# Altium project FROGSBORO.PrjPcb (part 2 of 2)

## Sheet SD.SchDoc
size A; DocumentNumber: 5; SheetNumber: 5; SheetTotal: 6
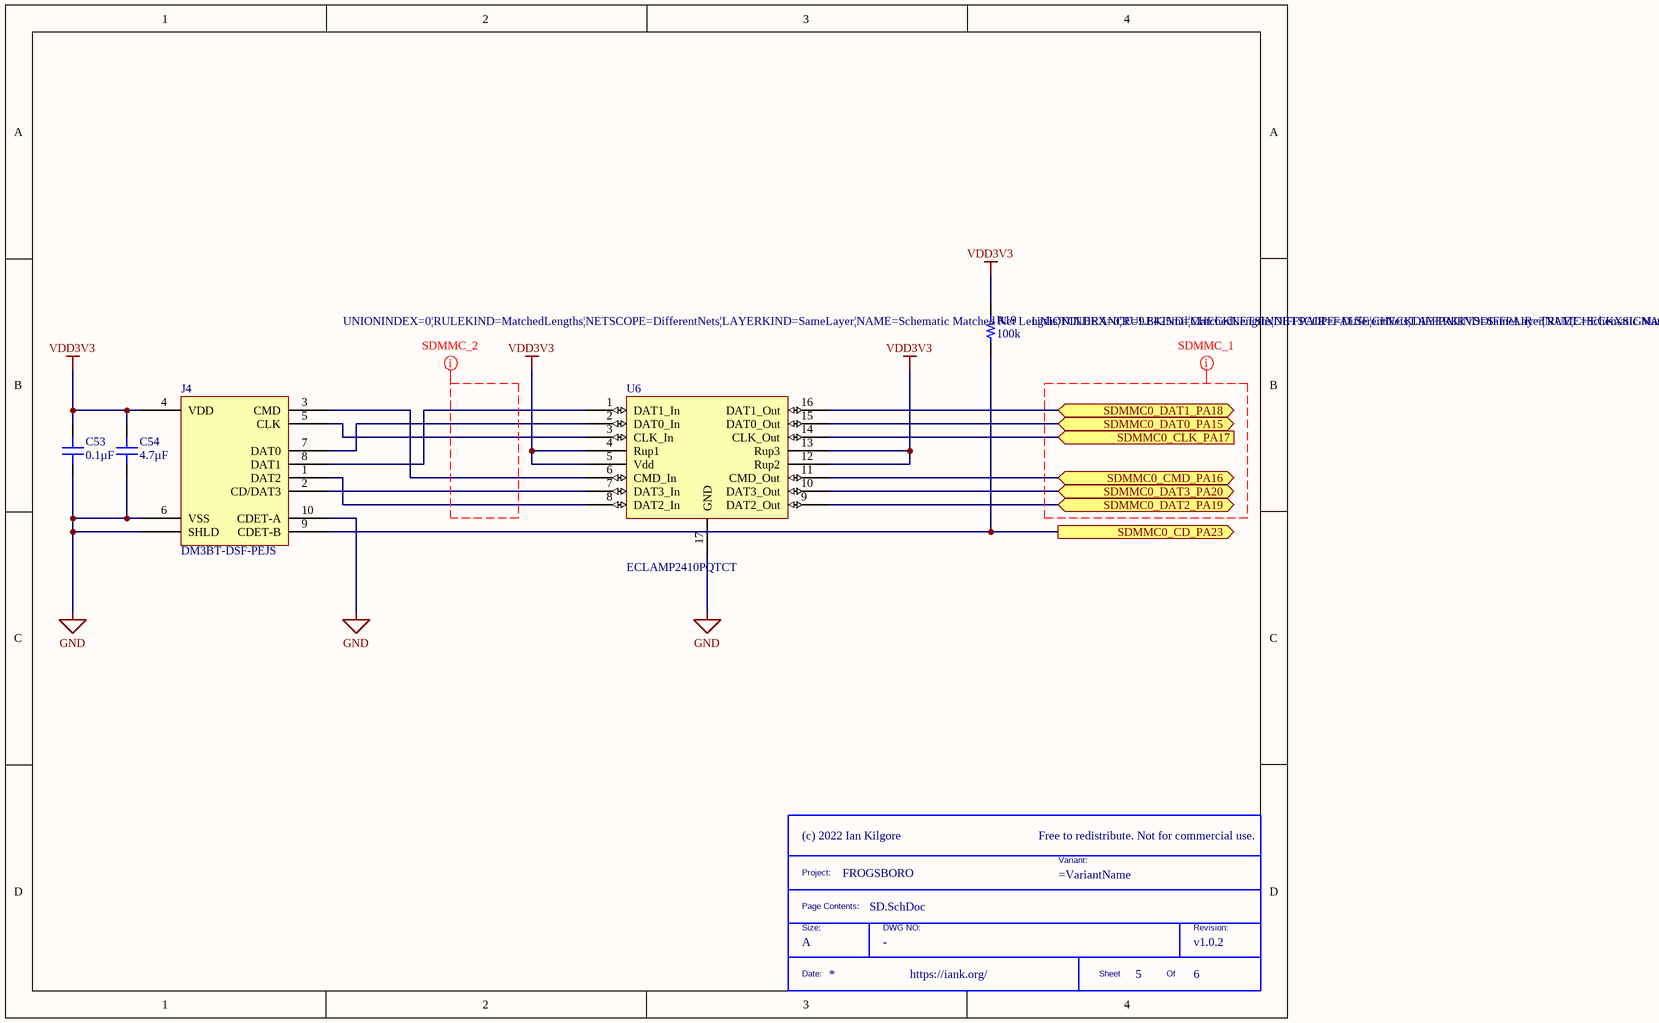
[diagram p4: SD.SchDoc]

### Parts
(Parts that share a designator on the sheet are numbered #1, #2 ... from top to bottom, then left to right.)
*#5  Size: A  (hidden comment: TitleBlock)  (graphical)
C53  0.1µF  [CAP 0402_1005]
C54  4.7µF  [CAP 0402_1005]
J4  DM3BT-DSF-PEJS  [HIROSE DM3BT-DSF-PEJS]
R19  100k  [RES 0402_1005]
U6  ECLAMP2410PQTCT  [SON50P160X65_HS-17N]

### Ports
SDMMC0_CD_PA23 (out), SDMMC0_CLK_PA17 (in), SDMMC0_CMD_PA16 (bidir), SDMMC0_DAT0_PA15 (bidir), SDMMC0_DAT1_PA18 (bidir), SDMMC0_DAT2_PA19 (bidir), SDMMC0_DAT3_PA20 (bidir)

### Nets
GND: C53.2 C54.1 J4.6(VSS) J4.10(CDET-A) J4.S(SHLD) U6.17(GND)
VDD3V3: C53.1 C54.2 J4.4(VDD) R19.2 U6.4(Rup1) U6.5(Vdd) U6.12(Rup2) U6.13(Rup3)
NetJ4_1: J4.1(DAT2) U6.8(DAT2_In)
NetJ4_2: J4.2(CD/DAT3) U6.7(DAT3_In)
NetJ4_3: J4.3(CMD) U6.6(CMD_In)
NetJ4_5: J4.5(CLK) U6.3(CLK_In)
NetJ4_7: J4.7(DAT0) U6.2(DAT0_In)
NetJ4_8: J4.8(DAT1) U6.1(DAT1_In)
NetJ4_9: J4.9(CDET-B) R19.1 ; port SDMMC0_CD_PA23
NetU1_H3: U6.16(DAT1_Out) ; port SDMMC0_DAT1_PA18
NetU1_H4: U6.14(CLK_Out) ; port SDMMC0_CLK_PA17
NetU1_J1: U6.9(DAT2_Out) ; port SDMMC0_DAT2_PA19
NetU1_J2: U6.11(CMD_Out) ; port SDMMC0_CMD_PA16
NetU1_J4: U6.10(DAT3_Out) ; port SDMMC0_DAT3_PA20
NetU1_K1: U6.15(DAT0_Out) ; port SDMMC0_DAT0_PA15

### Layout directives
rule Matched Net Lengths [Tolerance = 0.25mm]: (no net found under the mark)

### Notes on the sheet
- (in symbol TitleBlock) Free to redistribute. Not for commercial use.; Project:; Variant:; Page Contents:; Size:; DWG NO:; Revision:; Date:; Sheet; Of

### Library data of the parts
*#5 = TitleBlock: Custom Title Block; DWG: -
C53 = C0402C104K4PACTU: CAP CER 0.1UF 16V X5R 0402; Manufacturer: KEMET; Tolerance: ±10%; Part Number: C0402C104K4PACTU; Value: 0.1µF; Applications: General Purpose; Capacitance: 0.1µF; ComponentLink1Description: Datasheet; ComponentLink1URL: https://api.kemet.com/component-edge/download/datasheet/C0402C104K4PACTU.pdf; ComponentLink2Description: DigiKey Link; ComponentLink2URL: http://digikey.com/product-detail/en/kemet/C0402C104K4PACTU/399-7762-1-ND/3471485; Device Package: 0402 (1005 Metric); LastUpdated: 9/2/2020 1:02:03 AM; Lifecycle Status: Active; Minimum Order: 1; Mounting Type: Surface Mount, MLCC; Operating Temperature: -55°C ~ 85°C; Package / Case: 0402 (1005 Metric); Packaging: TapeAndReel; PartId: 11334; Part Status: Active; Price: 0.01; Series: SMD Comm X5R; Size / Dimension: 0.039" L x 0.020" W (1.00mm x 0.50mm); Supplier 1: DigiKey; Supplier Part Number 1: 399-7762-1-ND; Temperature Coefficient: X5R; Thickness (Max): 0.022" (0.55mm); Voltage - Rated: 16V
C54 = CL05A475KP5NRNC: CAP CER 4.7UF 10V X5R 0402; Manufacturer: Samsung Electro-Mechanics; Tolerance: ±10%; Part Number: CL05A475KP5NRNC; Value: 4.7µF; Applications: General Purpose; Capacitance: 4.7µF; ComponentLink1Description: Datasheet; ComponentLink1URL: http://www.samsungsem.com/kr/support/product-search/mlcc/CL05A475KP5NRNC.jsp; ComponentLink2Description: DigiKey Link; ComponentLink2URL: http://digikey.com/product-detail/en/samsung-electro-mechanics/CL05A475KP5NRNC/1276-1480-1-ND/3889566; Device Package: 0402 (1005 Metric); LastUpdated: 9/2/2020 1:02:23 AM; Lifecycle Status: Active; Minimum Order: 1; Mounting Type: Surface Mount, MLCC; Operating Temperature: -55°C ~ 85°C; Package / Case: 0402 (1005 Metric); Packaging: TapeAndReel; PartId: 2191; Part Status: Active; Price: 0.08; Series: CL; Size / Dimension: 0.039" L x 0.020" W (1.00mm x 0.50mm); Supplier 1: DigiKey; Supplier Part Number 1: 1276-1480-1-ND; Temperature Coefficient: X5R; Thickness (Max): 0.022" (0.55mm); Voltage - Rated: 10V
J4 = DM3BT-DSF-PEJS: CONN MICRO SD CARD PUSH-PUSH R/A; Manufacturer: Hirose Electric Co Ltd; Card Type: Secure Digital - microSD™; Connector Type: Connector and Ejector; Insertion, Removal Method: Push In, Push Out; Number of Positions: 10 (8 + 2); Part Number: DM3BT-DSF-PEJS; ComponentLink1Description: Datasheet; ComponentLink1URL: https://www.hirose.com/product/download/?distributor=digikey&type=specSheet&lang=en&num=DM3BT-DSF-PEJS; ComponentLink2Description: DigiKey Link; ComponentLink2URL: //digikey.com/product-detail/en/hirose-electric-co-ltd/DM3BT-DSF-PEJS/HR1942TR-ND/1982749; Contact Finish: Gold; Features: Switch; Height Above Board: 0.072" (1.83mm); LastUpdated: 12/16/2019 8:35:34 PM; Lifecycle Status: 0; Minimum Order: 1; Mounting Feature: Reverse - Bottom; Mounting Type: Surface Mount, Right Angle; Packaging: TapeAndReel; Part Status: Active; Price: 1.25; Series: DM3; Supplier 1: DigiKey; Supplier Part Number 1: HR1942TR-ND
R19 = CRCW0402100KFKEDC: RES SMD 100K OHM 1% 1/16W 0402; Manufacturer: Vishay Dale; Power (Watts): 0.063W, 1/16W; Resistance: 100 kOhms; Temperature Coefficient: ±100ppm/°C; Part Number: CRCW0402100KFKEDC; Value: 100k; ComponentLink1Description: Datasheet; ComponentLink1URL: http://www.vishay.com/docs/28773/crcwce3.pdf; ComponentLink2Description: DigiKey Link; ComponentLink2URL: http://digikey.com/product-detail/en/vishay-dale/CRCW0402100KFKEDC/541-3960-1-ND/7928643; Composition: Thick Film; Device Package: 0402 (1005 Metric); Height - Seated (Max): 0.014" (0.35mm); LastUpdated: 9/2/2020 1:07:49 AM; Lifecycle Status: Active; Minimum Order: 1; Number of Terminations: 2; Operating Temperature: -55°C ~ 155°C; Package / Case: 0402 (1005 Metric); Packaging: CutTape; PartId: 12665; Part Status: Active; Price: 0.10; Series: CRCW-C; Size / Dimension: 0.039" L x 0.020" W (1.00mm x 0.50mm); Supplier 1: DigiKey; Supplier Part Number 1: 541-3960-1-ND; Supplier Device Package: 0402; Tolerance: ±1%
U6 = ECLAMP2410PQTCT: ESD Suppressors / TVS Diodes 5V 6-Line AEC-Q100 SLP4016P16; Manufacturer: Semtech; Number of Channels: 8; ESD Protection: Yes; Supplier 1: Digi-Key; Manufacturer Part Number: ECLAMP2410PQTCT; RoHS: Yes; Category: Uncategorized; Stock 1: 575; Pricing 1: 1=1.60000, 10=1.42800, 100=1.11320, 500=0.91960, 1000=0.72600 (USD); Min Operating Temperature: -40°C; Max Operating Temperature: 125°C; Package Quantity: 1; Packaging: Tape and Reel; Length: 0.157inch; Width: 0.063inch; Height: 0.026inch; RoHS Compliant: Yes; ComponentLink1URL: https://datasheet.ciiva.com/29369/eclamp2410pq-29369285.pdf?src-supplier=Digi-Key; ComponentLink1Description: https://datasheet.ciiva.com/29369/eclamp2410pq-29369285.pdf?src-supplier=Digi-Key; ComponentLink2URL: https://datasheet.ciiva.com/29369/eclamp2410pq-29369287.pdf?src-supplier=Digi-Key; ComponentLink2Description: https://datasheet.ciiva.com/29369/eclamp2410pq-29369287.pdf?src-supplier=Digi-Key; ComponentLink3URL: https://datasheet.ciiva.com/29369/eclamp2410pq-29369288.pdf?src-supplier=Digi-Key; ComponentLink3Description: https://datasheet.ciiva.com/29369/eclamp2410pq-29369288.pdf?src-supplier=Digi-Key; Supplier Part Number 1: ECLAMP2410PQTCTCT-ND

## Sheet Connectors.SchDoc
size A; DocumentNumber: 6; SheetNumber: 6; SheetTotal: 6
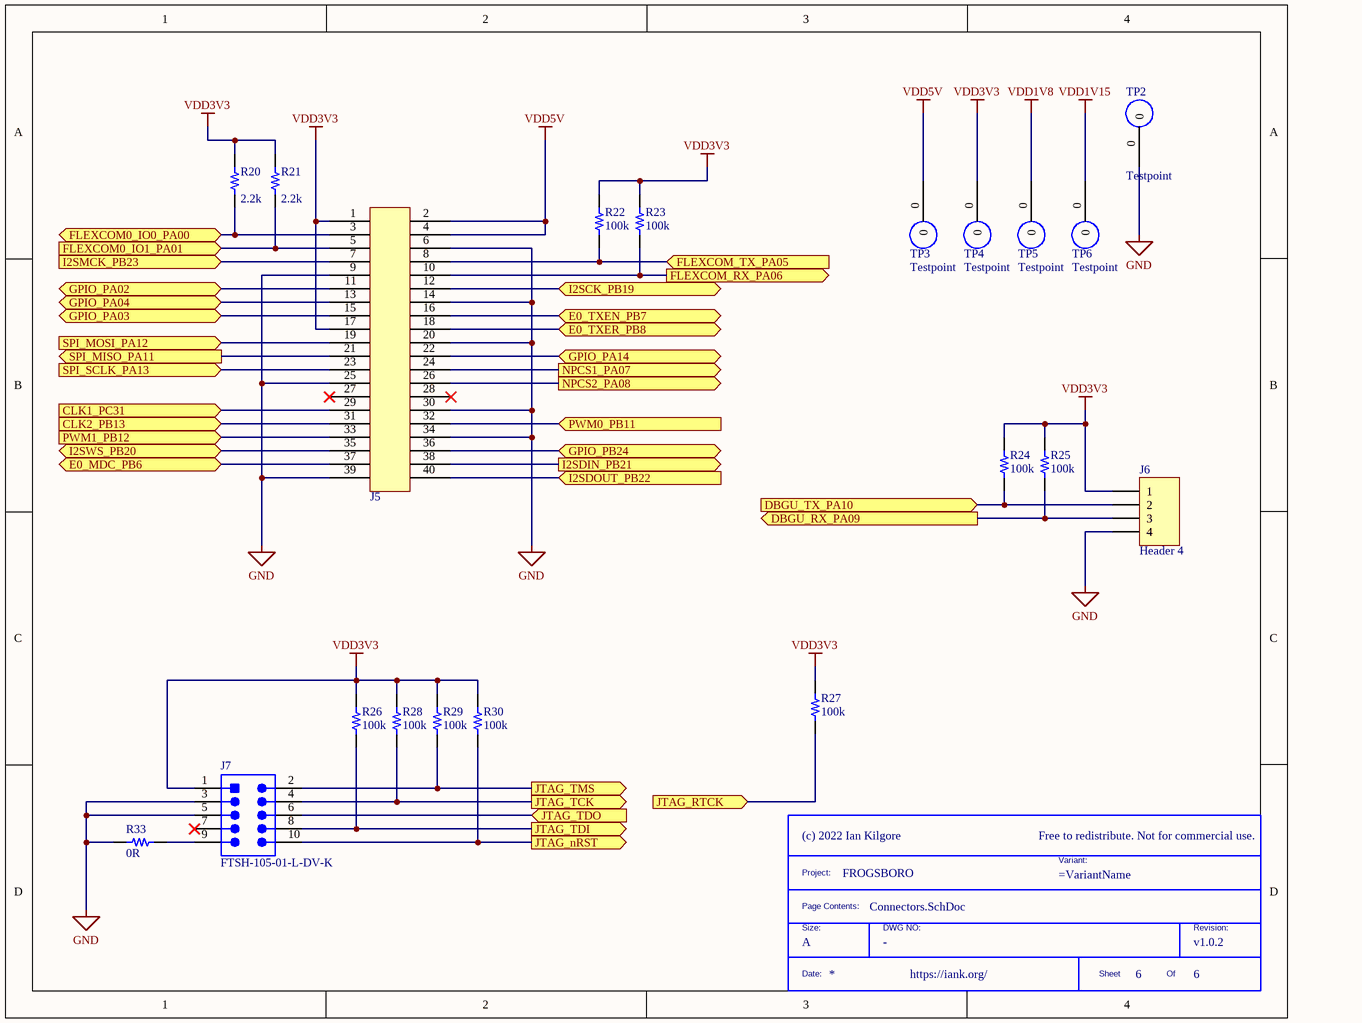
[diagram p5: Connectors.SchDoc]

### Parts
(Parts that share a designator on the sheet are numbered #1, #2 ... from top to bottom, then left to right.)
*#6  Size: A  (hidden comment: TitleBlock)  (graphical)
J5  DF23C-40DP-0.5V(92)  [DF23C-40DP-0.5V(92)]  (value not drawn)
J6  Header 4  [HDR1X4]
J7  FTSH-105-01-L-DV-K  [SMTC-FTSH-105-01-L-DV-K_V]
R20  2.2k  [RES 0402_1005]
R21  2.2k  [RES 0402_1005]
R22  100k  [RES 0402_1005]
R23  100k  [RES 0402_1005]
R24  100k  [RES 0402_1005]
R25  100k  [RES 0402_1005]
R26  100k  [RES 0402_1005]
R27  100k  [RES 0402_1005]
R28  100k  [RES 0402_1005]
R29  100k  [RES 0402_1005]
R30  100k  [RES 0402_1005]
R33  0R  [RES 0402_1005]
TP2  Testpoint  [Testpoint]  (no BOM)
TP3  Testpoint  [Testpoint]  (no BOM)
TP4  Testpoint  [Testpoint]  (no BOM)
TP5  Testpoint  [Testpoint]  (no BOM)
TP6  Testpoint  [Testpoint]  (no BOM)

### Ports
CLK1_PC31 (in), CLK2_PB13 (in), DBGU_RX_PA09 (out), DBGU_TX_PA10 (in), E0_MDC_PB6 (bidir), E0_TXEN_PB7 (bidir), E0_TXER_PB8 (bidir), FLEXCOM0_IO0_PA00 (bidir), FLEXCOM0_IO1_PA01 (in), FLEXCOM_RX_PA06 (out), FLEXCOM_TX_PA05 (in), GPIO_PA02 (bidir), GPIO_PA03 (bidir), GPIO_PA04 (bidir), GPIO_PA14 (bidir), GPIO_PB24 (bidir), I2SCK_PB19 (bidir), I2SDIN_PB21 (out), I2SDOUT_PB22 (in), I2SMCK_PB23 (in), I2SWS_PB20 (bidir), JTAG_nRST (out), JTAG_RTCK (in), JTAG_TCK (out), JTAG_TDI (out), JTAG_TDO (in), JTAG_TMS (out), NPCS1_PA07 (out), NPCS2_PA08 (out), PWM0_PB11 (in), PWM1_PB12 (in), SPI_MISO_PA11 (out), SPI_MOSI_PA12 (in), SPI_SCLK_PA13 (in)

### Nets
GND: J5.6 J5.9 J5.14 J5.20 J5.25 J5.30 J5.34 J5.39 J6.4 J7.3 J7.5 R33.2 TP2.0
VDD1V8: TP5.0
VDD1V15: TP6.0
VDD3V3: J5.1 J5.17 J6.1 J7.1 R20.2 R21.2 R22.2 R23.2 R24.2 R25.2 R26.2 R27.2 R28.2 R29.2 R30.2 TP4.0
VDD5V: J5.2 J5.4 TP3.0
NetJ5_3: J5.3 R20.1 ; port FLEXCOM0_IO0_PA00
NetJ5_5: J5.5 R21.1 ; port FLEXCOM0_IO1_PA01
NetJ5_7: J5.7 ; port I2SMCK_PB23
NetJ5_8: J5.8 R22.1 ; port FLEXCOM_TX_PA05
NetJ5_10: J5.10 R23.1 ; port FLEXCOM_RX_PA06
NetJ5_11: J5.11 ; port GPIO_PA02
NetJ5_12: J5.12 ; port I2SCK_PB19
NetJ5_13: J5.13 ; port GPIO_PA04
NetJ5_15: J5.15 ; port GPIO_PA03
NetJ5_16: J5.16 ; port E0_TXEN_PB7
NetJ5_18: J5.18 ; port E0_TXER_PB8
NetJ5_19: J5.19 ; port SPI_MOSI_PA12
NetJ5_21: J5.21 ; port SPI_MISO_PA11
NetJ5_22: J5.22 ; port GPIO_PA14
NetJ5_23: J5.23 ; port SPI_SCLK_PA13
NetJ5_24: J5.24 ; port NPCS1_PA07
NetJ5_26: J5.26 ; port NPCS2_PA08
NetJ5_29: J5.29 ; port CLK1_PC31
NetJ5_31: J5.31 ; port CLK2_PB13
NetJ5_32: J5.32 ; port PWM0_PB11
NetJ5_33: J5.33 ; port PWM1_PB12
NetJ5_35: J5.35 ; port I2SWS_PB20
NetJ5_36: J5.36 ; port GPIO_PB24
NetJ5_37: J5.37 ; port E0_MDC_PB6
NetJ5_38: J5.38 ; port I2SDIN_PB21
NetJ5_40: J5.40 ; port I2SDOUT_PB22
NetJ6_2: J6.2 R24.1 ; port DBGU_TX_PA10
NetJ6_3: J6.3 R25.1 ; port DBGU_RX_PA09
NetJ7_2: J7.2 R29.1 ; port JTAG_TMS
NetJ7_4: J7.4 R28.1 ; port JTAG_TCK
NetJ7_6: J7.6 ; port JTAG_TDO
NetJ7_8: J7.8 R26.1 ; port JTAG_TDI
NetJ7_9: J7.9 R33.1
NetJ7_10: J7.10 R30.1 ; port JTAG_nRST
NetR27_1: R27.1 ; port JTAG_RTCK

Not connected (* = marked no-connect by the designer): J5 27* 28*; J7 7*

### Notes on the sheet
- (in symbol TitleBlock) Free to redistribute. Not for commercial use.; Project:; Variant:; Page Contents:; Size:; DWG NO:; Revision:; Date:; Sheet; Of

### Library data of the parts
*#6 = TitleBlock: Custom Title Block; DWG: -
J5 = DF23C-40DP-0.5V(92): 0.5mm Pitch Low-Profile (H=1.5mm) Board to Board / FPC to Board Connectors; Manufacturer: Hirose; Connector Type: Plug,PCB; Number of Positions: 40; Current Rating: 300mA; Voltage Rating: 50V; Insulation Resistance: 500MR; Gender: Male; Mated Stacking Heights: 1.5mm; Row Spacing: 4.3mm; Supplier 1: Digi-Key; Manufacturer Part Number: DF23C-40DP-0.5V(92); RoHS: Yes; Category: Headers and Wire Housings; Stock 1: 419; Pricing 1: 1=1.25000, 10=1.09700, 25=1.03200, 50=0.98900, 100=0.94600, 250=0.86000, 500=0.77400, 1000=0.68800 (USD); Mount: Surface Mount; Contact Plating: Gold; Contact Material: Bronze,Copper Alloy; Housing Color: Black; Housing Material: Polymer; Min Operating Temperature: -35°C; Max Operating Temperature: 85°C; Package Quantity: 2000; Number of Rows: 2; Packaging: Tape and Reel; Number of Contacts: 40; Series: DF23; Contact Gender: Male; Termination: SMD/SMT; Orientation: Straight; Pitch: 0.5mm; Lead Free: Lead Free; REACH SVHC: No SVHC; Flammability Rating: UL94 V-0; RoHS Compliant: Yes; ComponentLink1URL: https://datasheet.ciiva.com/11751/0900766b80f5fb65-11751775.pdf?src-supplier=RSComponents; ComponentLink1Description: https://datasheet.ciiva.com/11751/0900766b80f5fb65-11751775.pdf?src-supplier=RSComponents; ComponentLink2URL: https://datasheet.ciiva.com/397/e68801060-397924.pdf?src-supplier=Digi-Key; ComponentLink2Description: https://datasheet.ciiva.com/397/e68801060-397924.pdf?src-supplier=Digi-Key; ComponentLink3URL: https://datasheet.ciiva.com/13568/e68801060-16897-13568044.pdf?src-supplier=Mouser; ComponentLink3Description: https://datasheet.ciiva.com/13568/e68801060-16897-13568044.pdf?src-supplier=Mouser; ComponentLink4URL: https://datasheet.ciiva.com/8038/e68801060-8038886.pdf?src-supplier=Element14; ComponentLink4Description: https://datasheet.ciiva.com/8038/e68801060-8038886.pdf?src-supplier=Element14; Supplier Part Number 1: H124750CT-ND
J6 = Header 4: Header, 4-Pin; LatestRevisionDate: 17-Jul-2002; LatestRevisionNote: Re-released for DXP Platform.; Publisher: Altium Limited
J7 = CMP-2000-05353-1: Male Header, Pitch 1.27 mm, 2 x 5 Position, Height 6.25 mm; Manufacturer: Samtec; Pitch: 0.050"(1.27mm); Other Names: Q3937619; Number of Positions: 10; Mating Products: SFMC-105-L2-S-D-TR-ND / -CONN.05"SURFACE10POSSMT / FLE-105-01-G-DV-TR-ND / -CONNSKT1.27MM10POSDUALSMD / FLE-105-01-G-DV-A-P-ND / -CONNSKT1.27MM10POSDUALSMD / FLE-105-01-G-DV-A-ND / -CONNSKT1.27MM10POSDUALSMD / CLP-105-02-G-D-P-TR-ND / -CONNRCPT10POSDUAL.05"SMD / SAM1155-05-ND / -CONNRCPT10POSDUAL.05"SMD / SAM1154-05-ND / -CONNRCPT10POSDUAL.05"SMD / SAM1153-05-ND / -CONNRCPT10POSDUAL.05"SMD / SAM1226-05-ND / -CONNRCPT.05"10POSDUALSMD; Number of Positions Loaded: All; Connector Type: Header,Unshrouded; Product Training Modules: Board-to-BoardConnectors; Datasheet Version: Rev. ET, 10/1995; Number of Rows: 2; Standard Package: 1; Package Description: Male Header, Pitch 1.27 mm, 2 x 5 Position, Height 5.97 mm, Tail Length 4.32 mm; Contact Finish Thickness: 10µin(0.25µm); Series: FTSH; Termination: Solder; Contact Type: MalePin; Color: Black; Package Reference: FTSH-105-01-L-DV-K; Family: RectangularConnectors-Headers,MalePins; Package URL: http://suddendocs.samtec.com/prints/ftsh-1xx-xx-xxx-dv-xxx-footprint.pdf; Packaging: Tube; Mounting Type: SurfaceMount; Category: Connectors,Interconnects; Datasheet URL: http://suddendocs.samtec.com/prints/ftsh-1xx-xx-xxx-dv-xxx-mkt.pdf; Row Spacing: 0.050"(1.27mm); Manufacturer URL: http://www.samtec.com/; Contact Mating Length: 0.120"(3.05mm); Contact Finish: Gold
R20 R21 = RCS04022K20FKED: RES SMD 2.2K OHM 1% 1/5W 0402; Part Number: RCS04022K20FKED; Value: 2.2k
R22-R30 = CRCW0402100KFKEDC: as R19 on sheet SD; Part Number: CRCW0402100KFKEDC; Value: 100k; ComponentLink1Description: Datasheet; ComponentLink1URL: http://www.vishay.com/docs/28773/crcwce3.pdf; ComponentLink2Description: DigiKey Link; ComponentLink2URL: http://digikey.com/product-detail/en/vishay-dale/CRCW0402100KFKEDC/541-3960-1-ND/7928643; Composition: Thick Film; Device Package: 0402 (1005 Metric); Height - Seated (Max): 0.014" (0.35mm); LastUpdated: 9/2/2020 1:07:49 AM; Lifecycle Status: Active; Minimum Order: 1; Number of Terminations: 2; Operating Temperature: -55°C ~ 155°C; Package / Case: 0402 (1005 Metric); Packaging: CutTape; PartId: 12665; Part Status: Active; Price: 0.10; Series: CRCW-C; Size / Dimension: 0.039" L x 0.020" W (1.00mm x 0.50mm); Supplier 1: DigiKey; Supplier Part Number 1: 541-3960-1-ND; Supplier Device Package: 0402; Tolerance: ±1%
R33 = CRG0402ZR: RES SMD 0 OHM JUMPER 1/16W 0402; Manufacturer: TE Connectivity Passive Product; Power (Watts): 0.063W, 1/16W; Part Number: CRG0402ZR; ComponentLink1Description: Datasheet; ComponentLink1URL: https://www.te.com/commerce/DocumentDelivery/DDEController?Action=srchrtrv&DocNm=1773204&DocType=DS&DocLang=English; ComponentLink2Description: DigiKey Link; ComponentLink2URL: http://digikey.com/product-detail/en/te-connectivity-passive-product/CRG0402ZR/A106025CT-ND/3477649; Composition: Thick Film; Device Package: 0402 (1005 Metric); Height - Seated (Max): 0.016" (0.40mm); LastUpdated: 9/2/2020 1:07:28 AM; Lifecycle Status: Active; Minimum Order: 1; Number of Terminations: 2; Operating Temperature: -55°C ~ 155°C; Package / Case: 0402 (1005 Metric); Packaging: CutTape; PartId: 20614; Part Status: Active; Price: 0.10; Series: CRG, Neohm; Size / Dimension: 0.039" L x 0.020" W (1.00mm x 0.50mm); Supplier 1: DigiKey; Supplier Part Number 1: A106025CT-ND; Supplier Device Package: 0402; Tolerance: Jumper; Value: 0R

## Nets that join several sheets
GND: Power (118 pins), SAM9X60_Core (8 pins), USB (16 pins), SD (6 pins), Connectors (13 pins)
VDD1V8: Power (37 pins), Connectors (TP5.0)
VDD1V15: Power (13 pins), Connectors (TP6.0)
VDD3V3: Power (24 pins), SAM9X60_Core (5 pins), SD (8 pins), Connectors (16 pins)
VDD5V: Power (5 pins), USB (11 pins), Connectors (J5.2 J5.4 TP3.0)
NetJ4_9: SAM9X60_IO (U1.C11), SD (J4.9 R19.1)
NetJ5_3: SAM9X60_IO (U1.L2), Connectors (J5.3 R20.1)
NetJ5_5: SAM9X60_IO (U1.L3), Connectors (J5.5 R21.1)
NetJ5_7: SAM9X60_IO (U1.C7), Connectors (J5.7)
NetJ5_8: SAM9X60_IO (U1.N3), Connectors (J5.8 R22.1)
NetJ5_10: SAM9X60_IO (U1.N1), Connectors (J5.10 R23.1)
NetJ5_11: SAM9X60_IO (U1.K2), Connectors (J5.11)
NetJ5_12: SAM9X60_IO (U1.A7), Connectors (J5.12)
NetJ5_13: SAM9X60_IO (U1.L1), Connectors (J5.13)
NetJ5_15: SAM9X60_IO (U1.K3), Connectors (J5.15)
NetJ5_16: SAM9X60_IO (U1.F4), Connectors (J5.16)
NetJ5_18: SAM9X60_IO (U1.D5), Connectors (J5.18)
NetJ5_19: SAM9X60_IO (U1.G4), Connectors (J5.19)
NetJ5_21: SAM9X60_IO (U1.G3), Connectors (J5.21)
NetJ5_22: SAM9X60_IO (U1.G2), Connectors (J5.22)
NetJ5_23: SAM9X60_IO (U1.G1), Connectors (J5.23)
NetJ5_24: SAM9X60_IO (U1.P2), Connectors (J5.24)
NetJ5_26: SAM9X60_IO (U1.P3), Connectors (J5.26)
NetJ5_29: SAM9X60_IO (U1.U13), Connectors (J5.29)
NetJ5_31: SAM9X60_IO (U1.A5), Connectors (J5.31)
NetJ5_32: SAM9X60_IO (U1.C5), Connectors (J5.32)
NetJ5_33: SAM9X60_IO (U1.A2), Connectors (J5.33)
NetJ5_35: SAM9X60_IO (U1.D9), Connectors (J5.35)
NetJ5_36: SAM9X60_IO (U1.B9), Connectors (J5.36)
NetJ5_37: SAM9X60_IO (U1.D3), Connectors (J5.37)
NetJ5_38: SAM9X60_IO (U1.A8), Connectors (J5.38)
NetJ5_40: SAM9X60_IO (U1.B8), Connectors (J5.40)
NetJ6_2: SAM9X60_IO (U1.M4), Connectors (J6.2 R24.1)
NetJ6_3: SAM9X60_IO (U1.N2), Connectors (J6.3 R25.1)
NetJ7_2: SAM9X60_Core (U1.N16), Connectors (J7.2 R29.1)
NetJ7_4: SAM9X60_Core (U1.P12), Connectors (J7.4 R28.1)
NetJ7_6: SAM9X60_Core (U1.N15), Connectors (J7.6)
NetJ7_8: SAM9X60_Core (U1.L15), Connectors (J7.8 R26.1)
NetJ7_10: SAM9X60_Core (R16.1), Connectors (J7.10 R30.1)
NetR15_1: Power (U2.12), SAM9X60_Core (R15.1)
NetR27_1: SAM9X60_Core (U1.N4), Connectors (R27.1)
NetR31_2: SAM9X60_IO (U1.E2), USB (R31.2 R32.2)
NetU1_H3: SAM9X60_IO (U1.H3), SD (U6.16)
NetU1_H4: SAM9X60_IO (U1.H4), SD (U6.14)
NetU1_J1: SAM9X60_IO (U1.J1), SD (U6.9)
NetU1_J2: SAM9X60_IO (U1.J2), SD (U6.11)
NetU1_J4: SAM9X60_IO (U1.J4), SD (U6.10)
NetU1_K1: SAM9X60_IO (U1.K1), SD (U6.15)
USBA_N: SAM9X60_Core (U1.U16), USB (J2.2 U4.3)
USBA_P: SAM9X60_Core (U1.T15), USB (J2.3 U4.6)
USBB_N: SAM9X60_Core (U1.R17), USB (J1.2 U3.3)
USBB_P: SAM9X60_Core (U1.T17), USB (J1.3 U3.6)
USBC_N: SAM9X60_Core (U1.P15), USB (J3.2 U5.3)
USBC_P: SAM9X60_Core (U1.P16), USB (J3.3 U5.6)

## Assembly variants
Default: not fitted J7 R10 R13 R22 R23 R27